# Altium schematic sheet STM32F103C8T6_MinimumCoreBoard.SchDoc
size A4
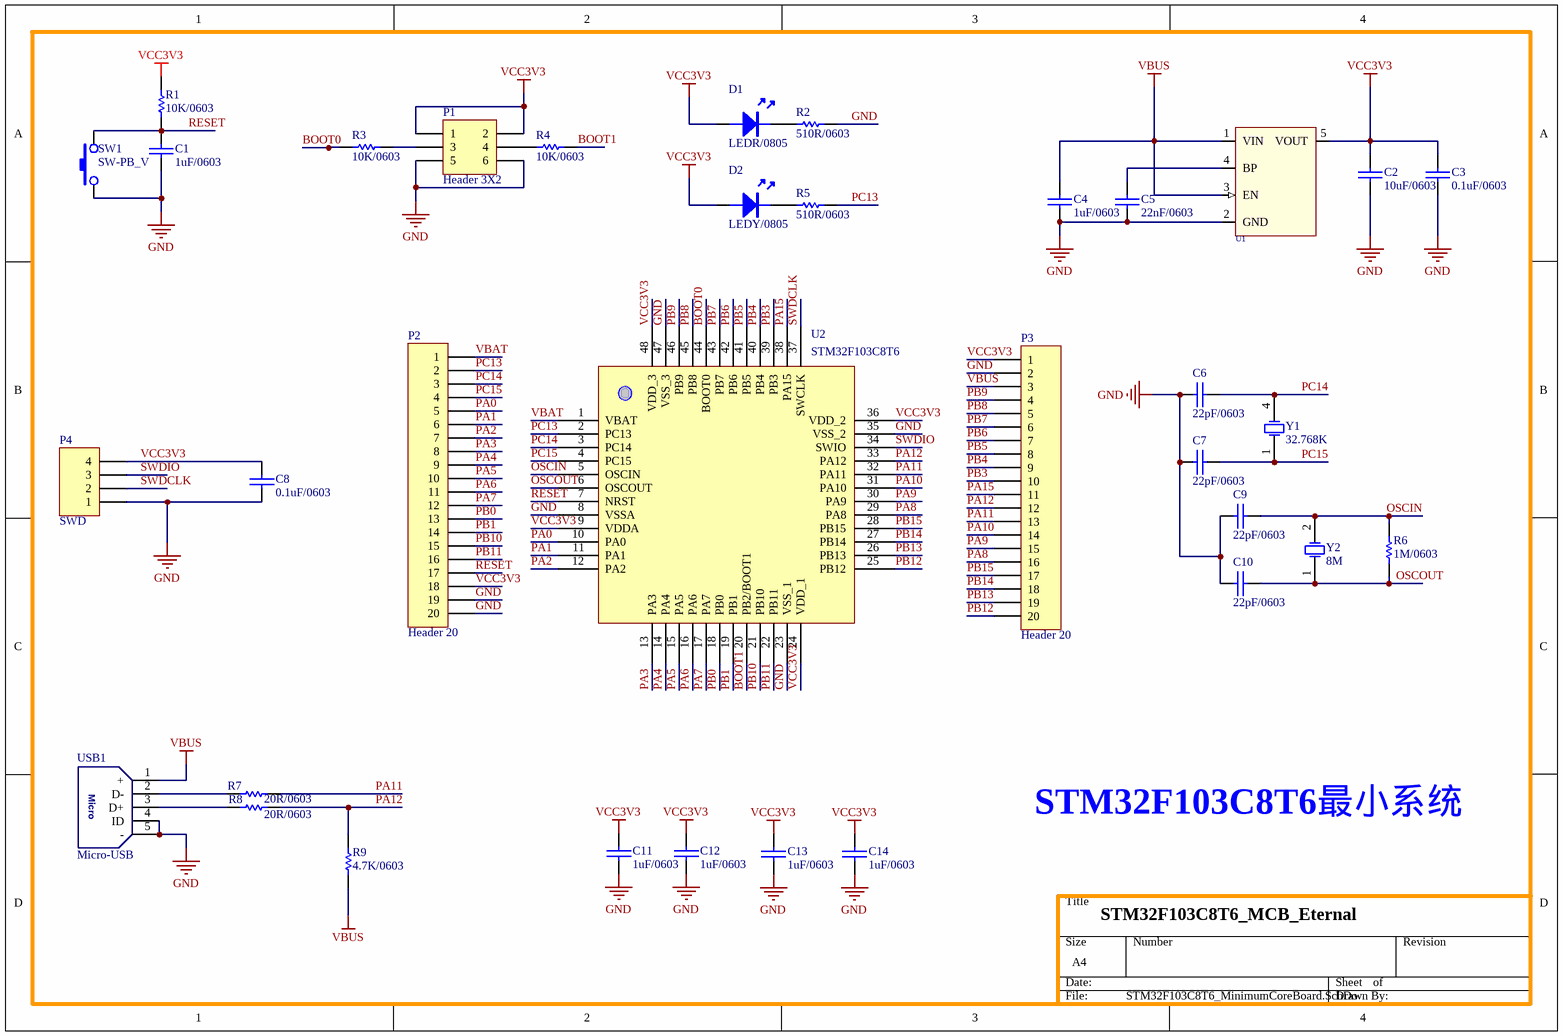
[diagram p0: STM32F103C8T6_MinimumCoreBoard.SchDoc]

## Parts
C1  1uF/0603  [0603C]
C2  10uF/0603  [0603C]
C3  0.1uF/0603  [0603C]
C4  1uF/0603  [0603C]
C5  22nF/0603  [0603C]
C6  22pF/0603  [0603C]
C7  22pF/0603  [0603C]
C8  0.1uF/0603  [0603C]
C9  22pF/0603  [0603C]
C10  22pF/0603  [0603C]
C11  1uF/0603  [0603C]
C12  1uF/0603  [0603C]
C13  1uF/0603  [0603C]
C14  1uF/0603  [0603C]
D1  LEDR/0805  [LED-0805R]
D2  LEDY/0805  [LED-0805Y]
P1  Header 3X2  [HDR-3X2]
P2  Header 20  [HDR1X20]
P3  Header 20  [HDR1X20]
P4  SWD  [HDR-1X4_H]
R1  10K/0603  [0603R]
R2  510R/0603  [0603R]
R3  10K/0603  [0603R]
R4  10K/0603  [0603R]
R5  510R/0603  [0603R]
R6  1M/0603  [0603R]
R7  20R/0603  [0603R]
R8  20R/0603  [0603R]
R9  4.7K/0603  [0603R]
SW1  SW-PB_V  [TSW SMD-3*6*2.5]
U1  RT9193  [SOT23-5L]  (value not drawn)
U2  STM32F103C8T6  [TQFP48 7x7_L]
USB1  Micro-USB  [USB-micro_B]
Y1  32.768K  [MC-306]
Y2  8M  [XTAL-49S DIP]

## Nets
GND: C1.1 C2.1 C3.1 C4.1 C5.1 C6.2 C7.2 C8.1 C9.2 C10.2 C11.1 C12.1 C13.1 C14.1 P1.5 P1.6 P2.19 P2.20 P3.2 P4.1 R2.2 SW1.1 U1.2(GND) U2.8(VSSA) U2.23(VSS_1) U2.35(VSS_2) U2.47(VSS_3) USB1.4(ID) USB1.5(-)
VBUS: C4.2 P3.3 R9.1 U1.1(VIN) U1.3(EN) USB1.1(+)
VCC3V3: C2.2 C3.2 C8.2 C11.2 C12.2 C13.2 C14.2 D1.A D2.A P1.1 P1.2 P2.18 P3.1 P4.4 R1.1 U1.5(VOUT) U2.9(VDDA) U2.24(VDD_1) U2.36(VDD_2) U2.48(VDD_3)
BOOT0: R3.1 U2.44(BOOT0)
BOOT1: R4.2 U2.20(PB2/BOOT1)
OSCIN: C9.1 R6.2 U2.5(OSCIN) Y2.2(OSC2)
OSCOUT: C10.1 R6.1 U2.6(OSCOUT) Y2.1(OSC1)
PA0: P2.5 U2.10(PA0)
PA1: P2.6 U2.11(PA1)
PA2: P2.7 U2.12(PA2)
PA3: P2.8 U2.13(PA3)
PA4: P2.9 U2.14(PA4)
PA5: P2.10 U2.15(PA5)
PA6: P2.11 U2.16(PA6)
PA7: P2.12 U2.17(PA7)
PA8: P3.16 U2.29(PA8)
PA9: P3.15 U2.30(PA9)
PA10: P3.14 U2.31(PA10)
PA11: P3.13 R7.2 U2.32(PA11)
PA12: P3.12 R8.2 R9.2 U2.33(PA12)
PA15: P3.11 U2.38(PA15)
PB0: P2.13 U2.18(PB0)
PB1: P2.14 U2.19(PB1)
PB3: P3.10 U2.39(PB3)
PB4: P3.9 U2.40(PB4)
PB5: P3.8 U2.41(PB5)
PB6: P3.7 U2.42(PB6)
PB7: P3.6 U2.43(PB7)
PB8: P3.5 U2.45(PB8)
PB9: P3.4 U2.46(PB9)
PB10: P2.15 U2.21(PB10)
PB11: P2.16 U2.22(PB11)
PB12: P3.20 U2.25(PB12)
PB13: P3.19 U2.26(PB13)
PB14: P3.18 U2.27(PB14)
PB15: P3.17 U2.28(PB15)
PC13: P2.2 R5.2 U2.2(PC13)
PC14: C6.1 P2.3 U2.3(PC14) Y1.4(OSC2)
PC15: C7.1 P2.4 U2.4(PC15) Y1.1(OSC1)
RESET: C1.2 P2.17 R1.2 SW1.2 U2.7(NRST)
SWDCLK: P4.2 U2.37(SWCLK)
SWDIO: P4.3 U2.34(SWIO)
VBAT: P2.1 U2.1(VBAT)
NetC5_2: C5.2 U1.4(BP)
NetD1_K: D1.K R2.1
NetD2_K: D2.K R5.1
NetP1_3: P1.3 R3.2
NetP1_4: P1.4 R4.1
NetR7_1: R7.1 USB1.2(D-)
NetR8_1: R8.1 USB1.3(D+)

## Notes on the sheet
- STM32F103C8T6最小系统
- STM32F103C8T6_MCB_Eternal
- (in symbol Micro-USB) Micro

## Library data of the parts
C1-C14 = CAP: 无极性电容
D1 D2 = LED
P1 = Header 3X2: Header, 3-Pin, Dual row; LatestRevisionDate: 17-Jul-2002; LatestRevisionNote: Re-released for DXP Platform.; Publisher: Altium Limited
P2 P3 = Header 20: Header, 20-Pin; LatestRevisionDate: 17-Jul-2002; LatestRevisionNote: Re-released for DXP Platform.; Publisher: Altium Limited
P4 = Header 4: Header, 4-Pin; LatestRevisionDate: 17-Jul-2002; LatestRevisionNote: Re-released for DXP Platform.; Publisher: Altium Limited
R1-R9 = RES
SW1 = SW-PB_V: SWITCH
U1 = RT9193X_5P: ICA_MFR_NAME: RICHTEK; ICA_PARTNUM: $$2191094$$RT9193-15CU5; Part Number: TMP-13
Y1 Y2 = XTAL: Crystal Oscillator; Published: 8-Jun-2000; LatestRevisionDate: 17-Jul-2002; LatestRevisionNote: Re-released for DXP Platform.; Publisher: Altium Limited